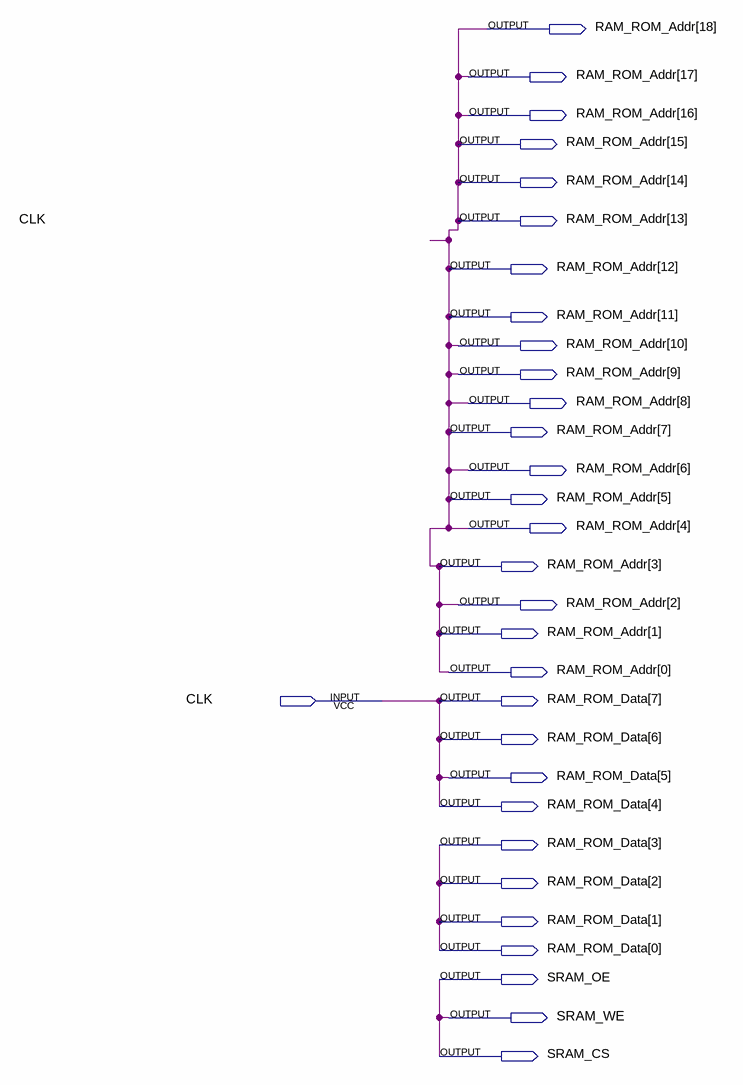
[diagram p0: schematic sheet]
// Quartus schematic memory_pin_test.bdf as structural Verilog: 0 symbols, 31 pins
module memory_pin_test (
  input  CLK,
  output [18:0] RAM_ROM_Addr,
  output [7:0] RAM_ROM_Data,
  output SRAM_OE,
  output SRAM_WE,
  output SRAM_CS
);


  assign RAM_ROM_Addr = {19{CLK}};
  assign {RAM_ROM_Data[7:4], RAM_ROM_Data[2:0]} = {{4{CLK}}, {3{RAM_ROM_Data[3]}}};
  assign SRAM_OE = SRAM_CS;
  assign SRAM_WE = SRAM_CS;
endmodule
